# EAGLE schematic wemos roaster (EAGLE 9.6.2)
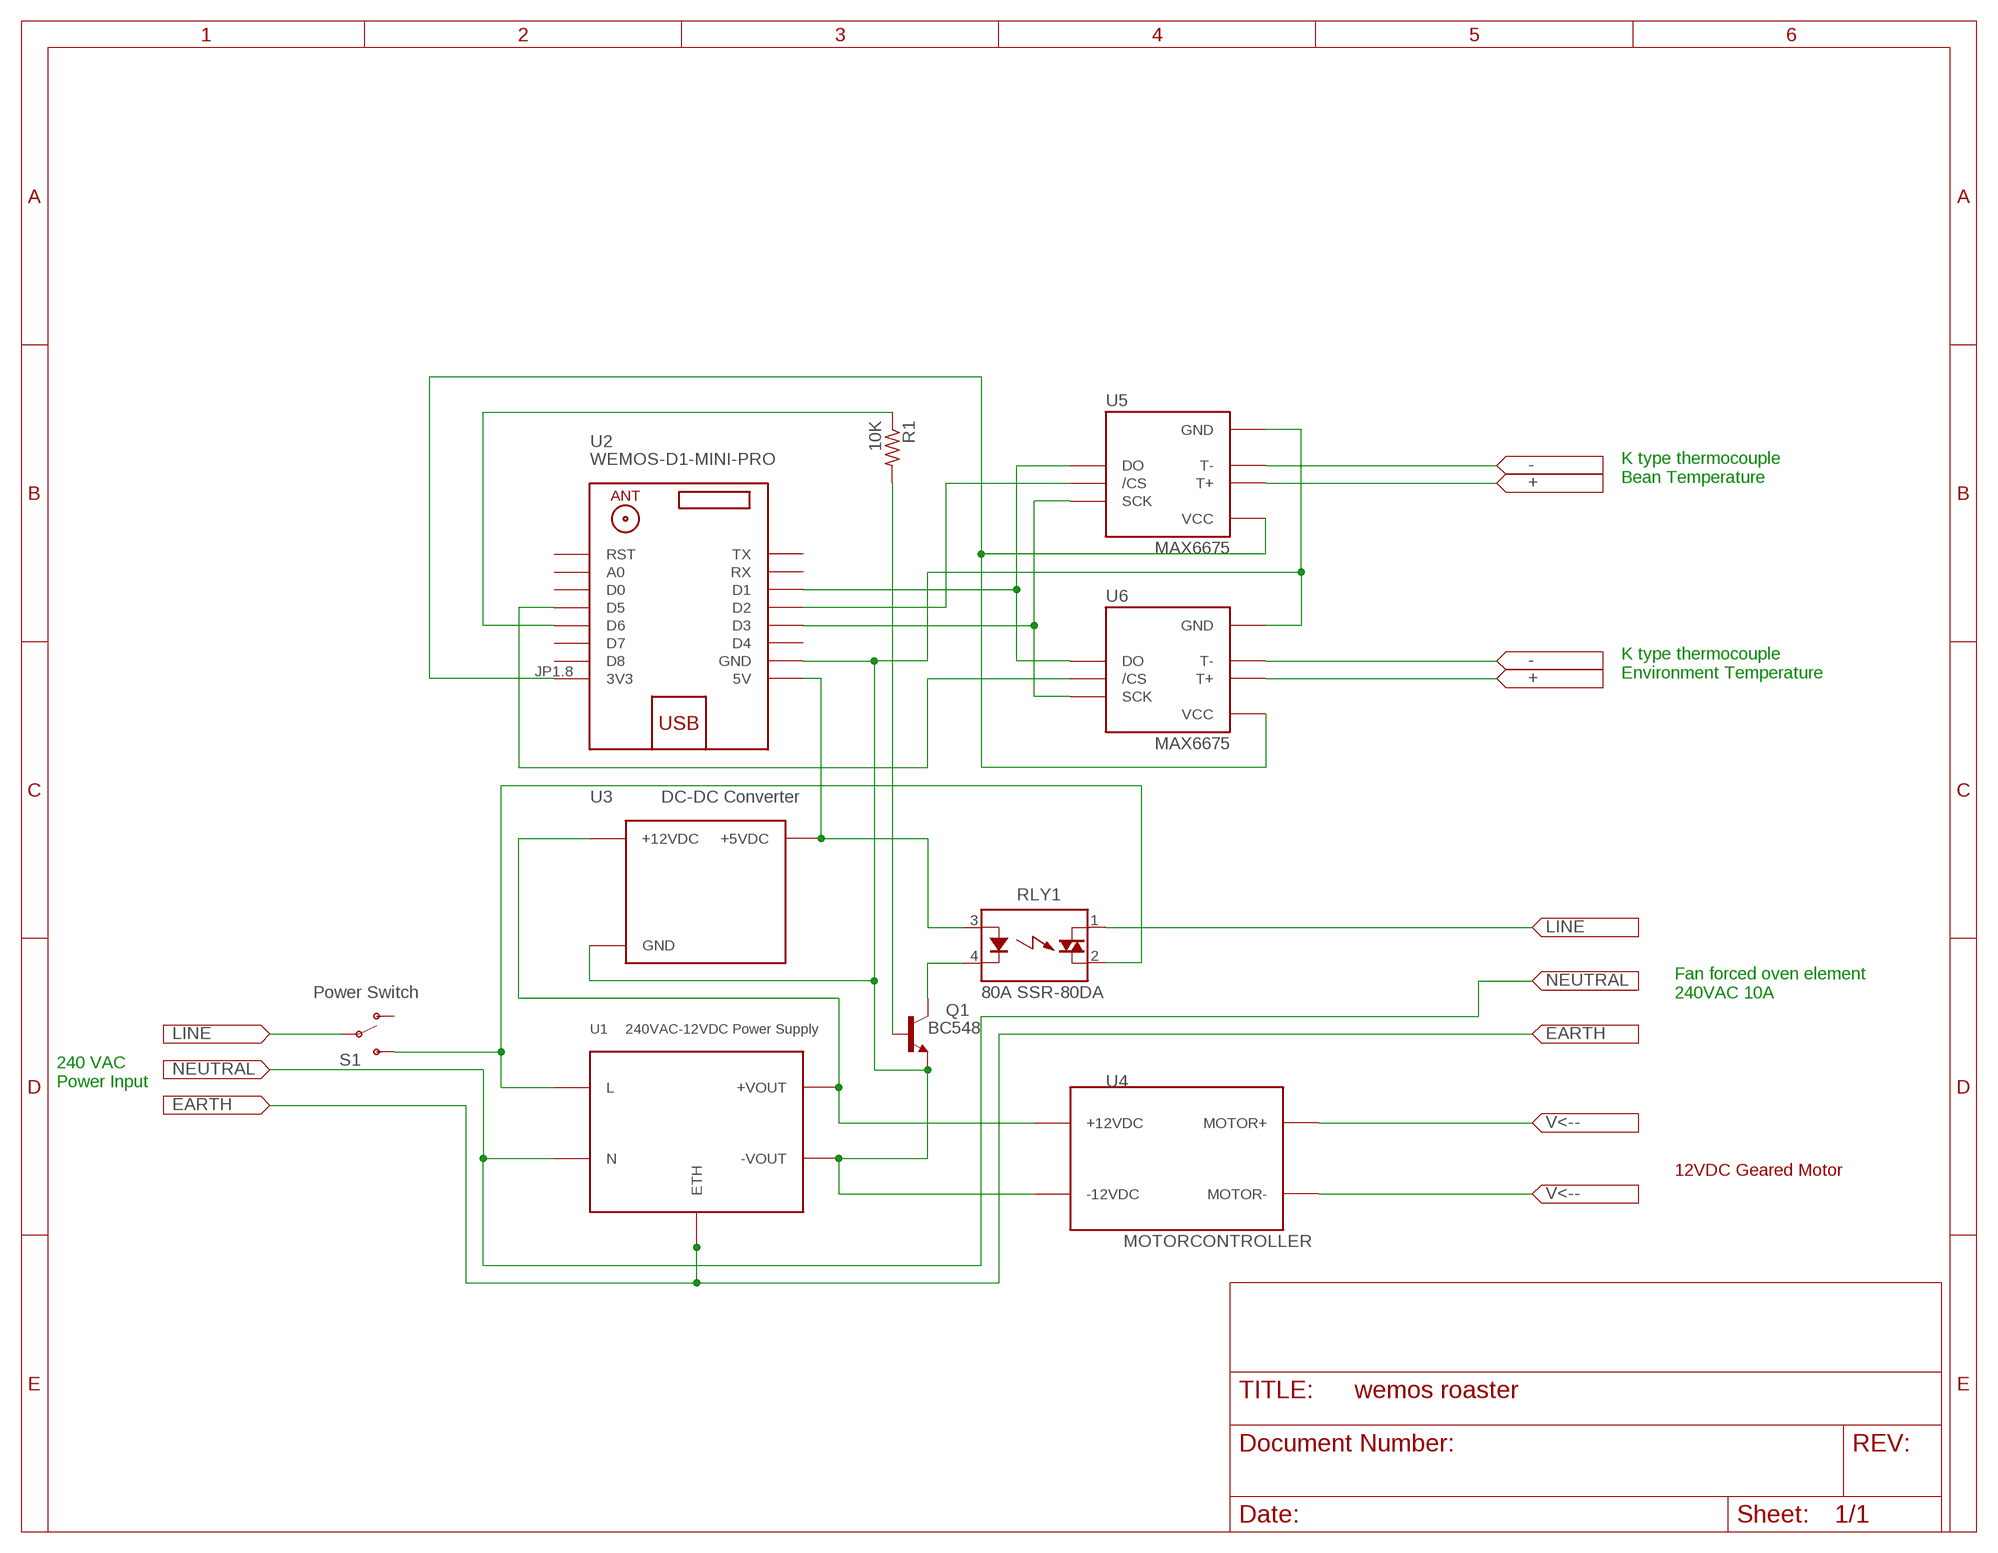
[diagram p0: schematic, sheet 1]

## Parts
Q1  BC548  [TO92-EBC]
R1  10K  R-US_0207/15  [0207/15]
RLY1  80A SSR-80DA  AQ2A2-J-ZP3  [AQ1-FLAT]
S1  Power Switch  SWITCH-SPDT-PTH-11.6X4.0MM  [SWITCH_SPDT_PTH_11.6X4.0MM]
U1  240VAC-12VDC Power Supply  171021801  [171021801]
U2  WEMOS-D1-MINI-PRO  [WEMOS-D1-MINI-PRO]
U3  DC-DC Converter  DCDCCONVERTER  [DCDC]
U4  MOTORCONTROLLER  [MOCONT]
U5  MAX6675  [SO08]
U6  MAX6675  [SO08]

## Nets
N$1: U1.EP1(ETH) U1.EP2(ETH) U1.EP3(ETH) U1.EP4(ETH)
N$2: U1.9(+VOUT) U3.+12VDC U4.+12VDC
N$3: Q1.C RLY1.4(K)
N$4: Q1.B R1.2
N$5: RLY1.2(DS2) S1.3(S) U1.1(L) U1.2(L) U1.3(L) U1.4(L)
N$6: U1.16(N)
N$7: RLY1.1(DS1)
N$8: R1.1 U2.JP1.5(D6)
N$9: U2.JP1.8(3V3) U5.4(VCC) U6.4(VCC)
N$10: U2.JP2.3(D1) U5.7(DO) U6.7(DO)
N$11: U2.JP2.5(D3) U5.5(SCK) U6.5(SCK)
N$12: U2.JP2.4(D2) U5.6(/CS)
N$13: U2.JP1.4(D5) U6.6(/CS)
N$14: U5.2(T-)
N$15: U5.3(T+)
N$16: U6.2(T-)
N$17: U6.3(T+)
N$19: RLY1.3(A) U2.JP2.8(5V) U3.+5VDC
N$20: Q1.E U1.13(-VOUT) U2.JP2.7(GND) U3.GND U4.-12VDC U5.1(GND) U6.1(GND)
N$21: U4.MOTOR+
N$22: U4.MOTOR-
N$23: S1.2(P)
Unconnected: S1.1(O) U2.JP1.1(RST) U2.JP1.2(A0) U2.JP1.3(D0) U2.JP1.6(D7) U2.JP1.7(D8) U2.JP2.1(TX) U2.JP2.2(RX) U2.JP2.6(D4)

## Notes on the sheet
- K type thermocouple
  Bean Temperature
- K type thermocouple
  Environment Temperature
- Fan forced oven element
  240VAC 10A
- 240 VAC 
  Power Input
- 12VDC Geared Motor

## Library data of the parts
Q1 = transistor-npn:BC548*: NPN Transistor
R1 = resistor:R-US_: RESISTOR, American symbol
RLY1 = relay:AQ?: SOLID STATE RELAY NAiS Source: http://www.mew-europe.com/.. en_ds_61601_0000.pdf; MPN: AQ2A2-ZP3/28VDC; OC_FARNELL: 1163552; OC_NEWARK: 13P1232
S1 = SparkFun-Switches:SWITCH-SPDT: Single Pole, Double Throw (SPDT) Switch Single-pole, double-throw (SPDT) switch. Variant Overview SMD-AYZ0202 Surface Mount DPDT Switch <https://www.sparkfun.com/products/597> (COM-00597) Used on e.g. LilyPad Arduino USB - ATmega32U4 Board <https://www.sparkfun.com/products/12049> PTH-11.6X4.0MM SPDT Mini Power Switch <https://www.sparkfun.com/products/102> (COM-00102) Used on e.g. SparkFun Simon Says - Through-Hole Soldering Kit <https://www.sparkfun.com/products/10547> (KIT-10547) PTH-11.6X4.0MM-KIT KIT version of SPDT Mini Power Switch - Simplifies soldering by removing tStop of switch pins - only one side can be soldered. PTH-11.6X4.0MM-LOCK LOCK version of SPDT Mini Power Switch - Offset pins hold switch in place for easier soldering. SMD-RIGHT-ANGLE Surface Mount Right Angle Switch <https://www.sparkfun.com/products/10860> (COM-10860) Used on e.g. SparkFun ESP8266 Thing <https://www.sparkfun.com/products/13231>; PROD_ID: SWCH-08261; SF_SKU: COM-00102
U1 = Power modules:171021801: DC DC CONVERTER 0.8V-17V Manufacturer's datasheet <https://katalog.we-online.de/pm/datasheet/171021801.pdf>; CREATED_BY: PCBLayout.com; DIGIKEY_PART_NUMBER: 732-12295-1-ND; MANUFACTURER: Wurth Electronics Inc.; MPN: 171021801; PACKAGE: 16-LGA
U2 = diy-modules:WEMOS-D1-MINI-PRO: WEMOS D1 mini Pro: Mini Wi-Fi Board based on ESP-8266EX chip More details can be found here: https://www.wemos.cc/product/d1-mini-pro.html Click here to find device on ebay.com <http://www.ebay.com/sch/wemos+d1+mini+pro>
U3 = wemosroaster:DCDCCONVERTER
U4 = wemosroaster:MOTORCONTROLLER
U5 U6 = adafruit:MAX6675